# EAGLE design schematic (EAGLE 9.2.2)
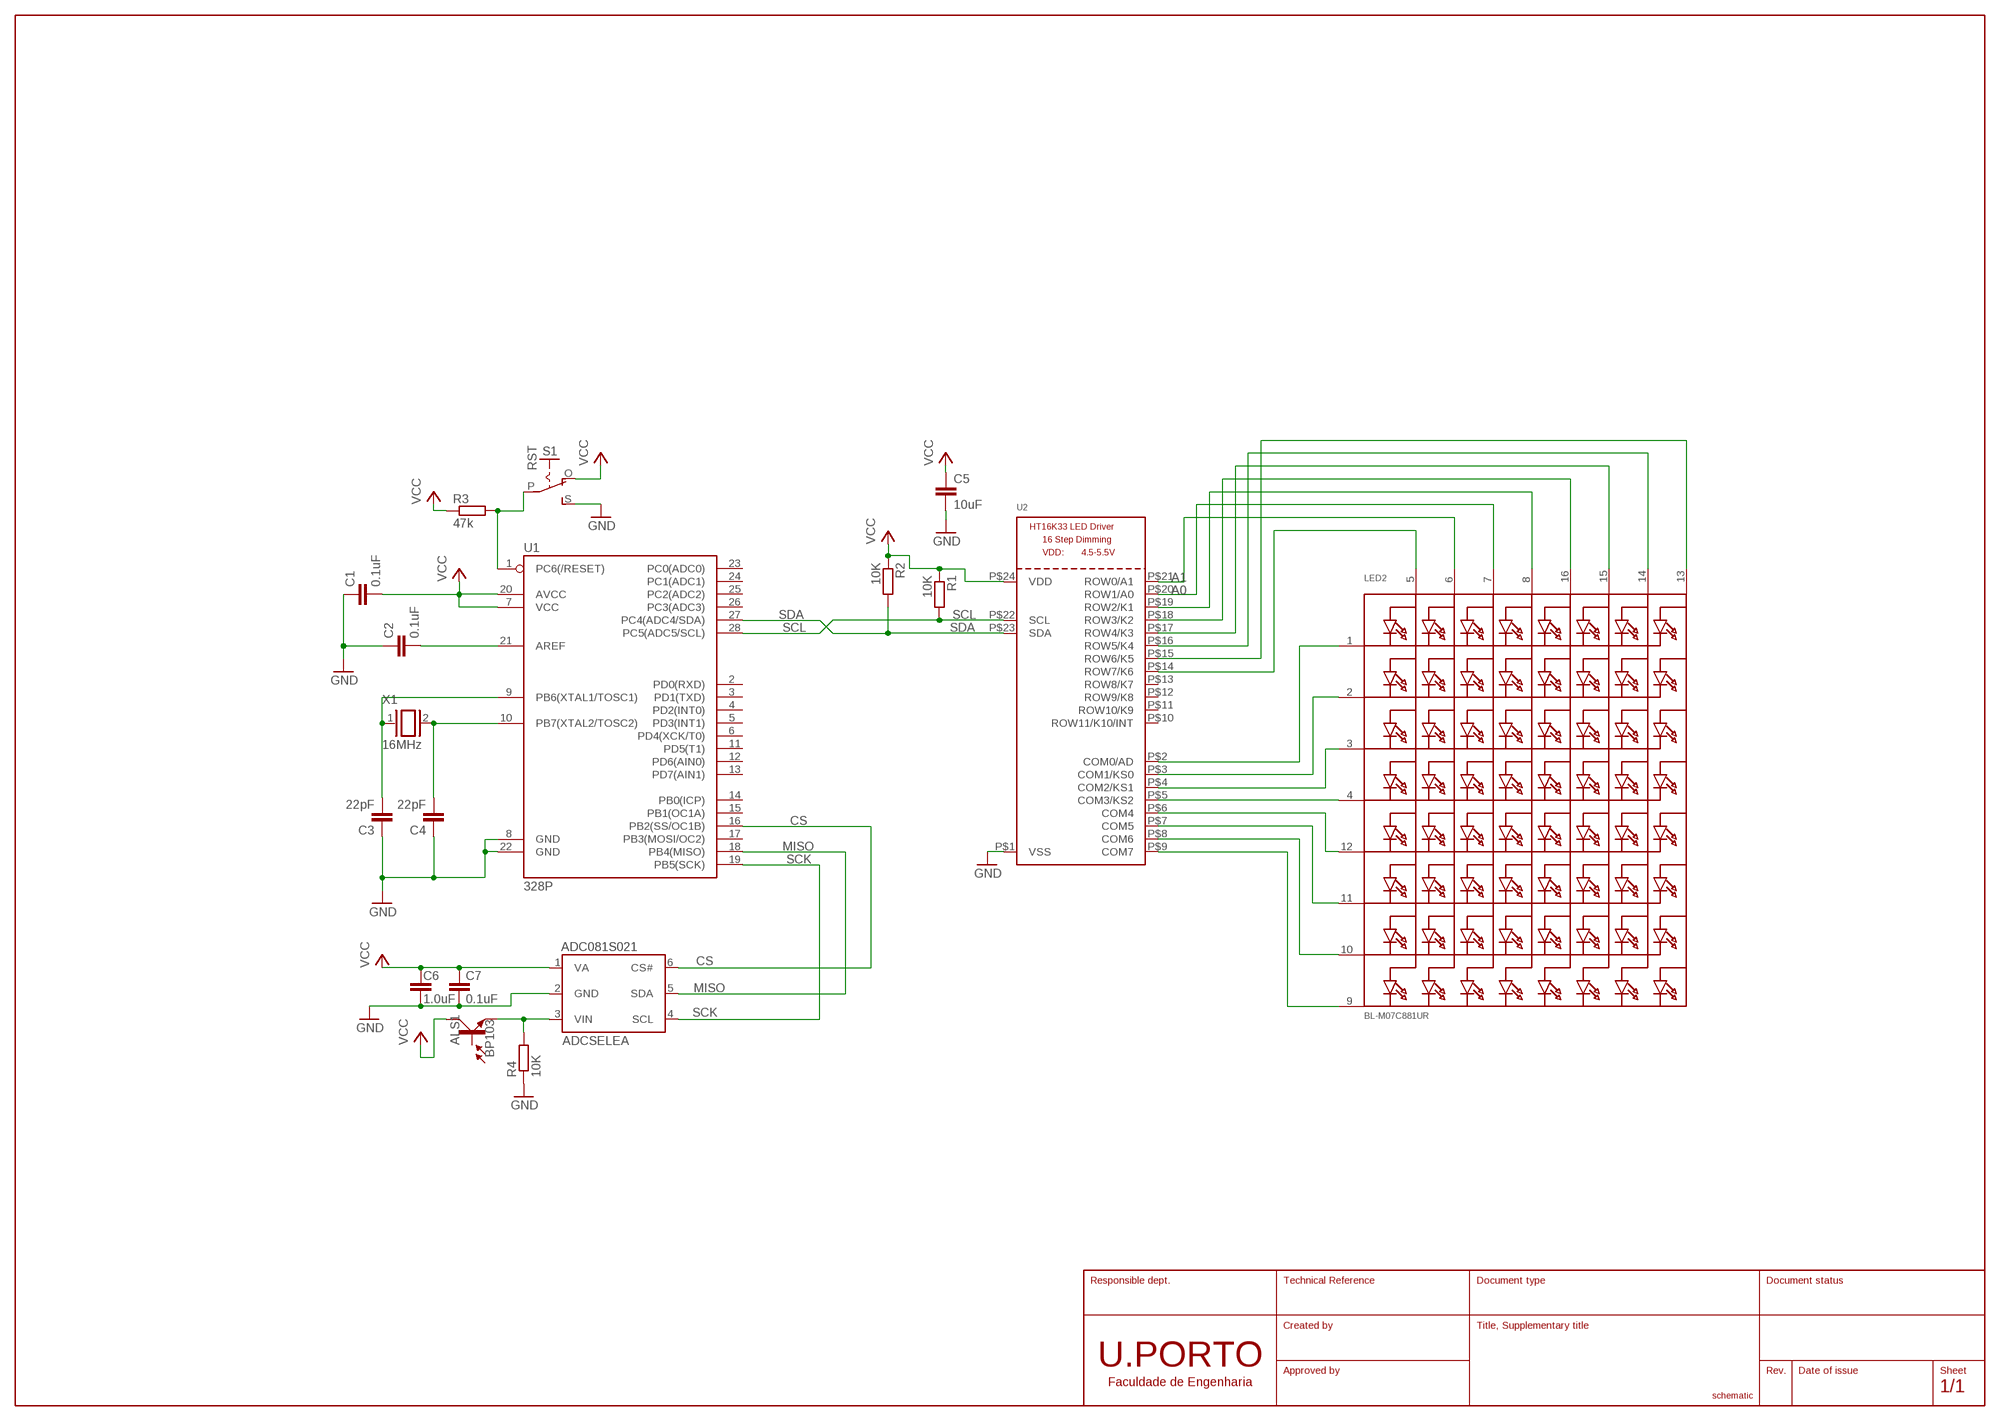
[diagram p0: schematic, sheet 1]

## Parts
ADC081S021  ADCSELEA  [SOT23]
ALS1  BP103  [BP103]
C1  0.1uF  0.1UF-0402-16V-10%  [0402]
C2  0.1uF  0.1UF-0402-16V-10%  [0402]
C3  22pF  22PF-0603-50V-5%  [0603]
C4  22pF  22PF-0603-50V-5%  [0603]
C5  10uF  10UF-0603-6.3V-20%  [0603]
C6  1.0uF  1.0UF-0402-16V-10%  [0402]
C7  0.1uF  0.1UF-0402-16V-10%  [0402]
LED2  BL-M07C881UR  DISP_SEGMENT_8X8_ROWCATHODE  [SEGMENT_BL-M07C881UR]
R1  10K  R-EU_M0805  [M0805]
R2  10K  R-EU_M0805  [M0805]
R3  47k  R-EU_M0805  [M0805]
R4  10K  R-EU_M0805  [M0805]
S1  RST  EG1218S  [EG1218]
U1  328P  ATMEGA328P-PDIP  [MICROCONTROLLER_DIP28]
U2  HT16K33_SOP24  [SOP24_300MIL]
X1  16MHz  XTAL/S  [QS]

## Nets
A0: LED2.7(A3) U2.P$20(ROW1/A0)
A1: LED2.6(A2) U2.P$21(ROW0/A1)
CS: ADC081S021.6(CS#) U1.16(PB2(SS/OC1B))
GND: ADC081S021.2(GND) C1.1 C2.1 C3.1 C4.1 C5.2 C6.2 C7.2 R4.1 S1.S U1.8(GND) U1.22(GND) U2.P$1(VSS)
MISO: ADC081S021.5(SDA) U1.18(PB4(MISO))
N$1: C4.2 U1.10(PB7(XTAL2/TOSC2)) X1.2
N$2: C3.2 U1.9(PB6(XTAL1/TOSC1)) X1.1
N$6: LED2.9(K8) U2.P$9(COM7)
N$7: LED2.10(K7) U2.P$8(COM6)
N$8: LED2.11(K6) U2.P$7(COM5)
N$9: LED2.12(K5) U2.P$6(COM4)
N$10: LED2.4(K4) U2.P$5(COM3/KS2)
N$11: LED2.3(K3) U2.P$4(COM2/KS1)
N$12: LED2.2(K2) U2.P$3(COM1/KS0)
N$13: LED2.1(K1) U2.P$2(COM0/AD)
N$14: LED2.8(A4) U2.P$19(ROW2/K1)
N$15: LED2.16(A5) U2.P$18(ROW3/K2)
N$16: LED2.15(A6) U2.P$17(ROW4/K3)
N$17: ADC081S021.3(VIN) ALS1.E R4.2
N$18: C2.2 U1.21(AREF)
N$19: LED2.5(A1) U2.P$14(ROW7/K6)
N$34: R3.2 S1.P U1.1(PC6(/RESET))
SCK: ADC081S021.4(SCL) U1.19(PB5(SCK))
SCL: R1.2 U1.28(PC5(ADC5/SCL)) U2.P$22(SCL)
SDA: R2.2 U1.27(PC4(ADC4/SDA)) U2.P$23(SDA)
SEG_F: LED2.14(A7) U2.P$16(ROW5/K4)
SEG_G: LED2.13(A8) U2.P$15(ROW6/K5)
VCC: ADC081S021.1(VA) ALS1.C C1.2 C5.1 C6.1 C7.1 R1.1 R2.1 R3.1 S1.O U1.7(VCC) U1.20(AVCC) U2.P$24(VDD)
Unconnected: ALS1.B U1.2(PD0(RXD)) U1.3(PD1(TXD)) U1.4(PD2(INT0)) U1.5(PD3(INT1)) U1.6(PD4(XCK/T0)) U1.11(PD5(T1)) U1.12(PD6(AIN0)) U1.13(PD7(AIN1)) U1.14(PB0(ICP)) U1.15(PB1(OC1A)) U1.17(PB3(MOSI/OC2)) U1.23(PC0(ADC0)) U1.24(PC1(ADC1)) U1.25(PC2(ADC2)) U1.26(PC3(ADC3)) U2.P$10(ROW11/K10/INT) U2.P$11(ROW10/K9) U2.P$12(ROW9/K8) U2.P$13(ROW8/K7)

## Library data of the parts
ADC081S021 = pmodals:ADCSELE
ALS1 = opto-trans-siemens:BP103: PHOTO TRANSISTOR; OC_FARNELL: unknown; OC_NEWARK: unknown
C1 C2 C7 = SparkFun-Capacitors:0.1UF: 0.1µF ceramic capacitors A capacitor is a passive two-terminal electrical component used to store electrical energy temporarily in an electric field.; PROD_ID: CAP-12416
C3 C4 = SparkFun-Capacitors:22PF: 22pF ceramic capacitors A capacitor is a passive two-terminal electrical component used to store electrical energy temporarily in an electric field.; PROD_ID: CAP-07876
C5 = SparkFun-Capacitors:10UF: 10.0µF ceramic capacitors A capacitor is a passive two-terminal electrical component used to store electrical energy temporarily in an electric field.; PROD_ID: CAP-11015
C6 = SparkFun-Capacitors:1.0UF: 1µF ceramic capacitors A capacitor is a passive two-terminal electrical component used to store electrical energy temporarily in an electric field.; PROD_ID: CAP-12417
LED2 = microbuilder:DISP_SEGMENT_8X8_ROWCATHODE: 8x8 LED Segment Displays: Row = Cathode 0.7" Red 8X8 Matrix, 1.9mm Round LEDs - BL-M07C881UR 1.2" Red 8x8 Matrix, 3.0mm Round LEDs - BL-M12A881UR 1.2" Red 8x8 Matrix, 3.0mm Square LEDs - BL-M12A883
R1-R4 = rcl:R-EU_: RESISTOR, European symbol; SPICEPREFIX: R
S1 = adafruit:EG1218: SLIDING SWITCH 0.1" spacing through hole, vertical SPDT slide switch http://www.ladyada.net/library/pcb/eaglelibrary.html
U1 = SBMI-SELE:ATMEGA328P-PDIP: Atmel 328P Through hole ATMEGA328P uC used in the Arduino 32kb flash, 1k EEPROM, 2k SRAM Datasheet <http://www.sparkfun.com/datasheets/Components/SMD/ATMega328.pdf> SparkFun Products Storefront component: AVR 28 Pin 20MHz 32K 6A/D - ATMega328P <https://www.sparkfun.com/products/9061> (COM-09061) SparkFun Simon Says - Through-Hole Soldering Kit <https://www.sparkfun.com/products/10547> (KIT-10547) SparkFun Learn to Solder - Simon Says <https://www.sparkfun.com/products/13708> (KIT-13708) SparkFun BigTime Watch Kit <https://www.sparkfun.com/products/11734> (KIT-11734) SparkFun ClockIt <https://www.sparkfun.com/products/10930> (KIT-10930) SparkFun Serial Enabled LCD Kit <https://www.sparkfun.com/products/10097> (LCD-10097) SparkFun Simon Tilts - Through Hole Soldering Kit <https://www.sparkfun.com/products/12634> (KIT-12634) SparkFun Frequency Counter Kit <https://www.sparkfun.com/products/10140> (KIT-10140) FabFM Radio Kit <https://www.sparkfun.com/products/11043> (KIT-11043) SparkFun Binary Blaster Kit <https://www.sparkfun.com/products/12037> (KIT-12037) SparkFun Metro-Gnome <https://www.sparkfun.com/products/9236> (KIT-09236) ATmega328 with Arduino Optiboot (Uno) <https://www.sparkfun.com/products/10524> (DEV-10524); PROD_ID: IC-09136
U2 = microbuilder:HT16K33_SOP24
X1 = special:XTAL/S: CRYSTAL

## Module ADC081S021
Ports: SDA(io) SCL(io) CS#(io) VA(io) GND(io) VIN(io)

### Library data of the parts

## Board
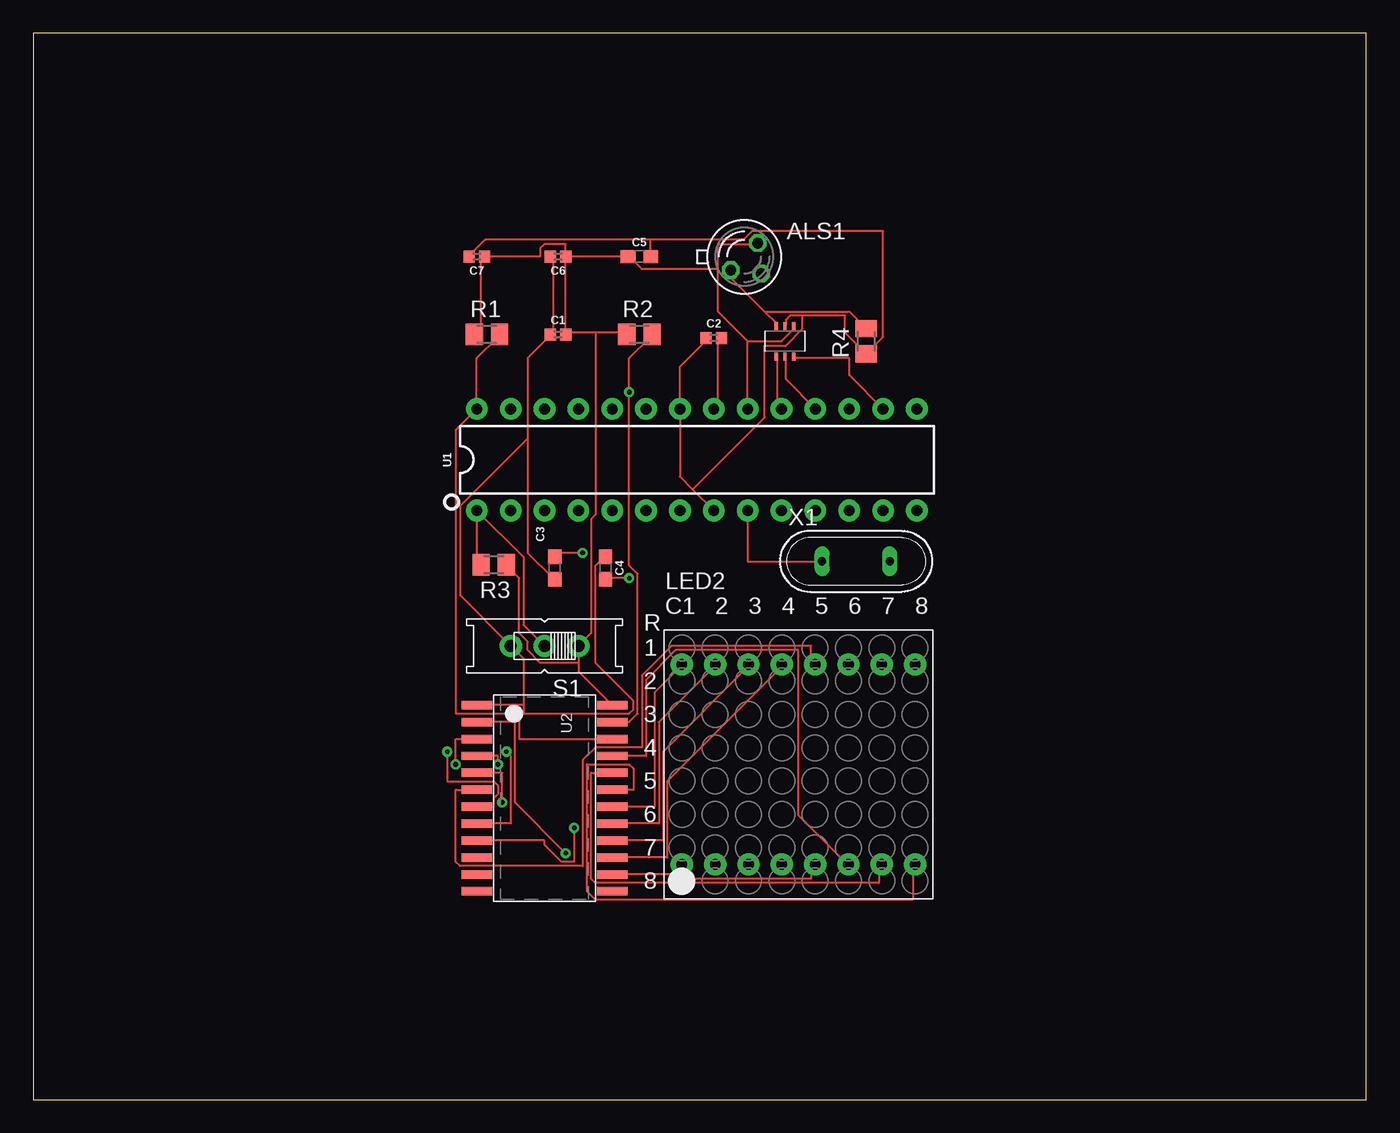
[diagram p1: board, top side]
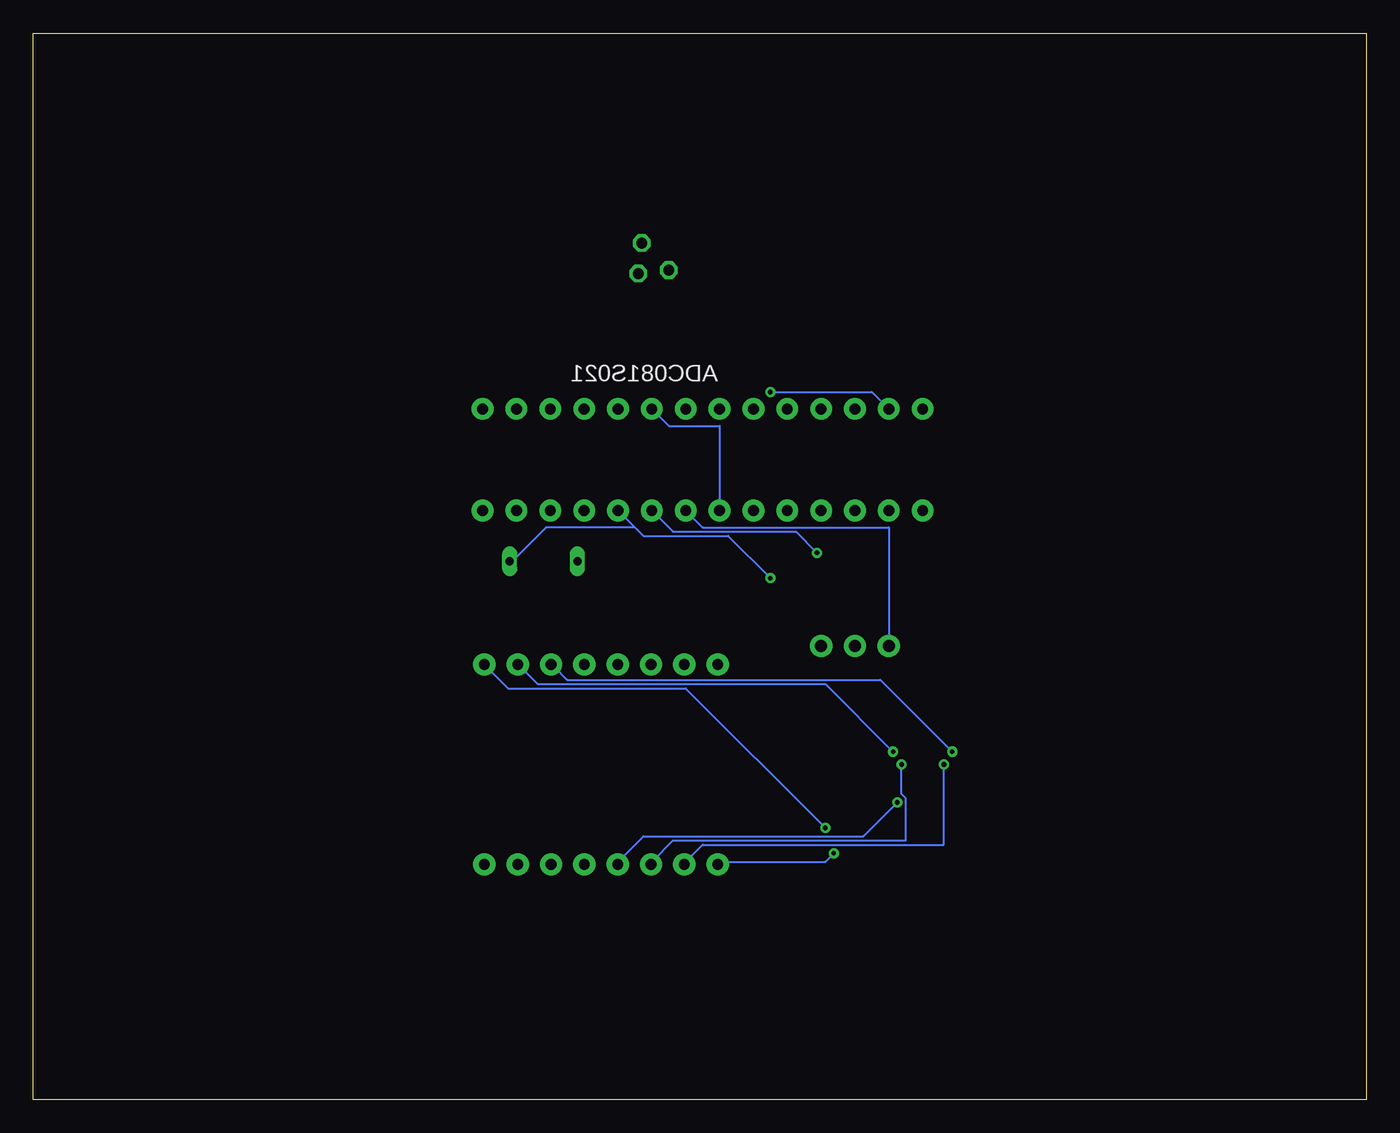
[diagram p2: board, bottom side, seen from below]

Size 100 x 80 mm. Coordinates in mm from the lower left corner, seen from the top.
Outline: 0,0 100,0 100,80 0,80 0,0
Copper layers (1*16): Top 0.035mm / dielectric 1.5mm / Bottom 0.035mm
Design rules "default": minimum track width 6mil, minimum drill 0.35mm, track to track 6mil, track to pad 6mil, pad to pad 6mil, via to via 6mil, smd to smd 6mil, copper to edge 40mil, drill to drill 6mil, minimum pad ring 10mil, minimum via ring 8mil, stop-mask expansion 4mil, vias tented up to drill 0mil, thermal gap 10mil

### Footprints (pad centres in the part's own frame; a part is rotated, then mirrored left to right if it is on the bottom)
SOT23 = smd 0.25 x 0.6: 1 -0.65,-1.15; 2 0,-1.15; 3 0.65,-1.15; 4 0.65,1.15; 5 0,1.15; 6 -0.65,1.15
BP103 = drill 0.813 octagon: B 1.27,-1.27; C 1.016,1.016; E -1.016,-1.016
0402 = smd 0.85 x 0.9: 1 -0.58,0; 2 0.58,0
0603 = smd 1.1 x 1: 1 -0.85,0; 2 0.85,0
SEGMENT_BL-M07C881UR = drill 0.8 pad 1.676: 1 -8.75,-7.5; 2 -6.25,-7.5; 3 -3.75,-7.5; 4 -1.25,-7.5; 5 1.25,-7.5; 6 3.75,-7.5; 7 6.25,-7.5; 8 8.75,-7.5; 9 8.75,7.5; 10 6.25,7.5; 11 3.75,7.5; 12 1.25,7.5; 13 -1.25,7.5; 14 -3.75,7.5; 15 -6.25,7.5; 16 -8.75,7.5
M0805 = smd 1.3 x 1.6: 1 -0.95,0; 2 0.95,0
EG1218 = drill 0.9 pad 1.676: O -2.54,0; P 0,0; S 2.54,0
MICROCONTROLLER_DIP28 = drill 0.813 pad 1.626: 1 -16.51,-3.81; 2 -13.97,-3.81; 3 -11.43,-3.81; 4 -8.89,-3.81; 5 -6.35,-3.81; 6 -3.81,-3.81; 7 -1.27,-3.81; 8 1.27,-3.81; 9 3.81,-3.81; 10 6.35,-3.81; 11 8.89,-3.81; 12 11.43,-3.81; 13 13.97,-3.81; 14 16.51,-3.81; 15 16.51,3.81; 16 13.97,3.81; 17 11.43,3.81; 18 8.89,3.81; 19 6.35,3.81; 20 3.81,3.81; 21 1.27,3.81; 22 -1.27,3.81; 23 -3.81,3.81; 24 -6.35,3.81; 25 -8.89,3.81; 26 -11.43,3.81; 27 -13.97,3.81; 28 -16.51,3.81
SOP24_300MIL = smd 0.635 x 2.286: P$1 -6.985,-5.08; P$2 -5.715,-5.08; P$3 -4.445,-5.08; P$4 -3.175,-5.08; P$5 -1.905,-5.08; P$6 -0.635,-5.08; P$7 0.635,-5.08; P$8 1.905,-5.08; P$9 3.175,-5.08; P$10 4.445,-5.08; P$11 5.715,-5.08; P$12 6.985,-5.08; P$13 6.985,5.08; P$14 5.715,5.08; P$15 4.445,5.08; P$16 3.175,5.08; P$17 1.905,5.08; P$18 0.635,5.08; P$19 -0.635,5.08; P$20 -1.905,5.08; P$21 -3.175,5.08; P$22 -4.445,5.08; P$23 -5.715,5.08; P$24 -6.985,5.08
QS = drill 0.61 long: 1 -2.54,0; 2 2.54,0

### Placement (x,y rotation side)
ADC081S021  56.39,56.9 180 top
ALS1  53.34,63.25 0 top
C1  39.37,57.4 0 top
C2  51.05,57.15 0 top
C3  39.12,39.88 90 top
C4  42.93,39.88 270 top
C5  45.47,63.25 0 top
C6  39.37,63.25 180 top
C7  33.27,63.25 180 top
LED2  57.4,25.15 0 top
R1  34.04,57.4 0 top
R2  45.47,57.4 0 top
R3  34.54,40.13 180 top
R4  62.48,56.9 90 top
S1  38.35,34.04 180 top
U1  49.78,48.01 0 top
U2  38.35,22.61 270 top
X1  61.72,40.39 0 top

### Tracks (layer width: path | path; a pad name or v marks a point on that pad's centre or on a via)
A0
  Top 0.152: U2.P$20 41.85,24.51 41.85,16.57 42.16,16.26 63.44,16.26 63.44,17.53 LED2.7
A1
  Top 0.152: U2.P$21 45.97,25.78 45.97,31.5 48.2,33.72 57.4,33.72 57.4,21.34 60.9,17.84 LED2.6
CS
  Top 0.152: U1.16 61.21,54.36 61.21,55.63 57.09,55.63 ADC081S021.6
GND
  Top 0.152: 36.77,29.59 36.77,33.08 S1.S 32,37.85 32,44.51 37.08,49.59 | 36.77,29.59 36.77,28.96 44.7,28.96 45.02,29.27 45.02,29.91 42.16,32.77 42.16,40.07 42.8,40.7 C4.1 | 36.77,29.59 U2.P$1 | C6.2 38.99,63.25 38.99,57.53 C1.1 38.67,57.21 37.08,55.63 37.08,49.59 | 37.08,49.59 37.08,41.02 38.99,39.12 C3.1 | 46.29,64.52 33.91,64.52 32.96,63.56 32.96,63.25 C7.2 | 46.29,64.52 46.29,63.25 C5.2 | 57.72,58.8 60.9,58.8 60.9,57.53 R4.1 | 57.72,58.8 56.77,58.8 56.45,58.48 56.45,58.17 ADC081S021.2 | C2.1 50.42,56.9 48.51,54.99 U1.22 48.51,46.74 49.47,45.78 | 49.47,45.78 U1.8 | 57.72,58.8 57.72,57.85 56.45,56.58 54.86,56.58 54.86,51.18 49.47,45.78 | 46.29,64.52 53.28,64.52 53.91,65.15 63.75,65.15 63.75,57.21 R4.1 | R4.1
  Bottom 0.152: S1.S 35.81,42.93 49.78,42.93 U1.8
MISO
  Top 0.152: U1.18 56.45,54.04 56.45,55.63 ADC081S021.5
N$1  (via drill 0.35)
  Top 0.152: v44.7,39.12 43.12,39.12 C4.2
  Bottom 0.152: v44.7,39.12 47.88,42.29 54.23,42.29 54.86,42.93 | U1.10 54.86,42.93 | 54.86,42.93 61.53,42.93 64.07,40.39 X1.2
N$2  (via drill 0.35)
  Top 0.152: v41.21,41.02 39.31,41.02 C3.2 | X1.1 53.59,40.39 U1.9
  Bottom 0.152: v41.21,41.02 42.8,42.61 52.01,42.61 U1.9
N$6  (via drill 0.35)
  Top 0.152: U2.P$9 38.35,19.43 38.35,19.11 39.62,17.84 40.58,17.84 v40.58,20.38
  Bottom 0.152: v40.58,20.38 51.05,30.86 64.39,30.86 65.98,32.45 LED2.9
N$7  (via drill 0.35)
  Top 0.152: U2.P$8 35.81,20.7 35.81,25.78 v35.5,26.1
  Bottom 0.152: v35.5,26.1 40.58,31.18 62.17,31.18 63.44,32.45 LED2.10
N$8  (via drill 0.35)
  Top 0.152: U2.P$7 34.54,21.97 34.54,22.61 34.86,22.92 34.86,23.56 34.54,23.88 31.05,23.88 v31.05,26.1
  Bottom 0.152: v31.05,26.1 36.45,31.5 59.94,31.5 60.9,32.45 LED2.11
N$9
  Top 0.152: U2.P$6 31.69,23.24 31.69,17.84 32,17.53 41.21,17.53 41.21,25.46 42.16,26.42 45.66,26.42 45.66,31.81 47.88,34.04 58.36,34.04 58.36,32.77 LED2.12
N$10  (via drill 0.35)
  Top 0.152: U2.P$5 35.18,24.51 v35.18,22.29
  Bottom 0.152: v35.18,22.29 37.72,19.75 54.23,19.75 56.13,17.84 LED2.4
N$11  (via drill 0.35)
  Top 0.152: U2.P$4 34.86,25.78 v34.86,25.15
  Bottom 0.152: v34.86,25.15 34.86,22.92 34.54,22.61 34.54,19.43 52.01,19.43 53.59,17.84 LED2.3
N$12  (via drill 0.35)
  Top 0.152: U2.P$3 31.69,27.05 v31.69,25.15
  Bottom 0.152: v31.69,25.15 31.69,19.11 49.78,19.11 51.05,17.84 LED2.2
N$13  (via drill 0.35)
  Top 0.152: U2.P$2 36.13,28.32 36.13,22.29 v39.94,18.48
  Bottom 0.152: v39.94,18.48 40.58,17.84 48.51,17.84 LED2.1
N$14
  Top 0.152: U2.P$19 45.02,23.24 45.02,24.83 44.7,25.15 41.53,25.15 41.53,15.62 42.16,14.99 65.98,14.99 65.98,17.53 LED2.8
N$15
  Top 0.152: U2.P$18 46.61,21.97 46.61,30.54 48.51,32.45 LED2.16
N$16
  Top 0.152: U2.P$17 46.93,20.7 46.93,28.32 51.05,32.45 LED2.15
N$17
  Top 0.152: 54.86,59.12 52.32,61.66 ALS1.E | 54.86,59.12 55.82,58.17 ADC081S021.3 | 54.86,59.12 61.21,59.12 R4.2
N$18
  Top 0.152: U1.21 51.37,52.13 51.37,56.9 C2.2
N$19
  Top 0.152: U2.P$14 47.88,16.89 48.2,16.57 58.36,16.57 58.36,17.53 LED2.5
N$34
  Top 0.152: R3.2 33.59,40.39 33.27,40.7 U1.1 36.77,40.7 36.77,35.62 S1.P
SCK
  Top 0.152: U1.19 55.82,52.13 55.82,55.63 ADC081S021.4
SCL
  Top 0.152: R1.2 34.86,57.21 33.27,55.63 U1.28 31.69,50.23 31.69,28.96 36.13,28.96 36.45,28.64 36.45,27.05 U2.P$22
SDA  (via drill 0.35)
  Top 0.152: U2.P$23 44.7,28.32 45.34,28.96 45.34,39.43 44.7,40.07 v44.7,53.09 44.7,55.63 46.29,57.21 R2.2
  Bottom 0.152: U1.27 37.08,53.09 v44.7,53.09
SEG_F
  Top 0.152: U2.P$16 47.24,19.43 47.24,26.1 53.59,32.45 LED2.14
SEG_G
  Top 0.152: U2.P$15 47.56,18.16 47.56,23.88 56.13,32.45 LED2.13
VCC
  Top 0.152: 40.89,32.77 38.04,32.77 37.08,33.72 37.08,34.35 36.45,34.99 36.45,39.12 35.5,40.07 R3.1 | 40.89,32.77 S1.O 41.85,34.99 41.85,43.56 42.16,43.88 42.16,57.53 | U2.P$24 40.89,32.13 40.89,32.77 | R1.1 33.27,57.53 33.59,57.85 33.59,63.25 C7.1 38.04,63.25 38.04,63.88 38.35,64.2 39.94,64.2 C6.1 | 42.16,57.53 44.39,57.53 R2.1 | 42.16,57.53 40.26,57.53 C1.2 39.94,57.53 C6.1 | C6.1 C5.1 44.7,63.25 45.66,62.29 51.37,62.29 | 53.59,56.9 56.13,56.9 57.09,57.85 ADC081S021.1 | U1.20 53.59,56.9 | 51.37,62.29 51.37,59.12 53.59,56.9 | 51.37,62.29 51.37,64.2 54.23,64.2 ALS1.C
  Bottom 0.152: U1.7 48.51,50.55 52.32,50.55 U1.20